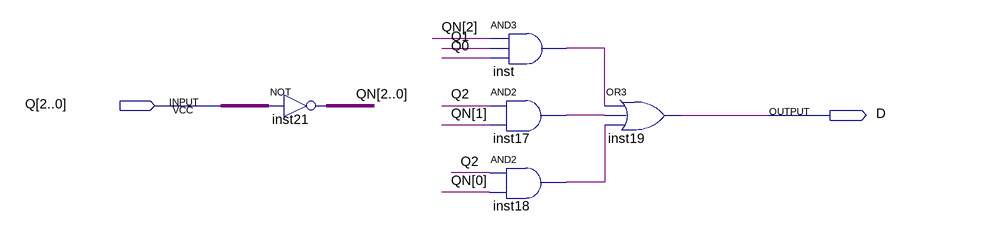
[diagram p0: schematic sheet]
// Quartus schematic D2.bdf as structural Verilog: 5 symbols, 2 pins
module D2 (
  input  [2:0] Q,
  output D
);

  wire inst17_out, inst18_out, inst_out;
  wire [2:0] QN;

  assign QN = ~Q;  // NOT inst21, 3 bits wide
  and inst (inst_out, QN[2], Q[1], Q[0]);
  and inst17 (inst17_out, Q[2], QN[1]);
  and inst18 (inst18_out, Q[2], QN[0]);
  or inst19 (D, inst_out, inst17_out, inst18_out);
endmodule
